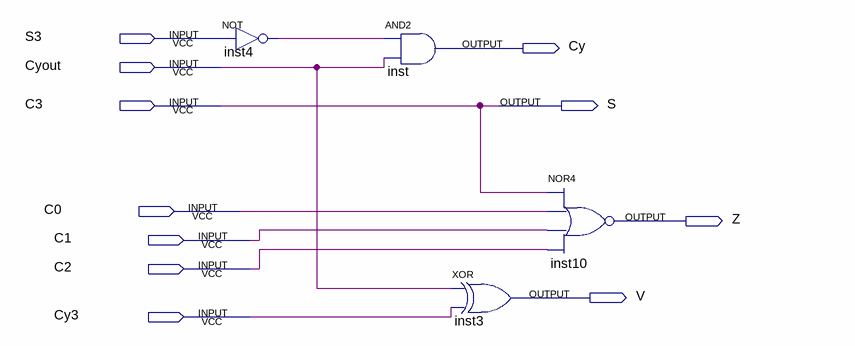
[diagram p0: schematic sheet]
// Quartus schematic state4bits.bdf as structural Verilog: 4 symbols, 11 pins
module state4bits (
  input  S3,
  input  Cyout,
  input  C3,
  input  C0,
  input  C1,
  input  C2,
  input  Cy3,
  output Cy,
  output S,
  output Z,
  output V
);

  wire inst4_out;

  not inst4 (inst4_out, S3);
  and inst (Cy, inst4_out, Cyout);
  xor inst3 (V, Cyout, Cy3);
  nor inst10 (Z, C3, C0, C1, C2);

  assign S = C3;
endmodule
